# Altium project PCB_Project2.PrjPCB
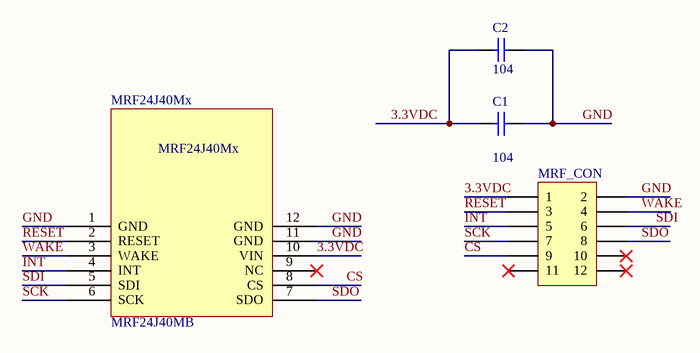
[diagram p0: Sheet2.SchDoc]
1 sheet, 4 parts. Net scope: global (net labels, ports and power ports of the same name join across sheets).
Board file: PCB1.PcbDoc

## Sheet Sheet2.SchDoc
size A

### Parts
C1  value 104  [CN1.5]  (hidden comment: Cap)
C2  value 104  [CN1.5]  (hidden comment: Cap)
MRF24J40Mx  MRF24J40MB  [MRF24J40MB]
MRF_CON  Header 6X2  [HDR2X6]  (value not drawn)

### Nets
3.3VDC: C1.2 C2.1 MRF24J40Mx.10(VIN) MRF_CON.1
CS: MRF24J40Mx.8(CS) MRF_CON.9
GND: C1.1 C2.2 MRF24J40Mx.1(GND) MRF24J40Mx.11(GND) MRF24J40Mx.12(GND) MRF_CON.2
INT: MRF24J40Mx.4(INT) MRF_CON.5
RESET: MRF24J40Mx.2(RESET) MRF_CON.3
SCK: MRF24J40Mx.6(SCK) MRF_CON.7
SDI: MRF24J40Mx.5(SDI) MRF_CON.6
SDO: MRF24J40Mx.7(SDO) MRF_CON.8
WAKE: MRF24J40Mx.3(WAKE) MRF_CON.4

Not connected (* = marked no-connect by the designer): MRF24J40Mx 9(NC)*; MRF_CON 10* 11* 12*

### Library data of the parts
C1 C2 = Cap: Capacitor; Published: 8-Jun-2000; LatestRevisionDate: 17-Jul-2002; LatestRevisionNote: Re-released for DXP Platform.; PackageReference: RAD-0.3; Publisher: Altium Limited; PackageDescription: Radial Cap, Thru-Hole; 2 Leads; 0.3 in Pin Spacing
MRF_CON = Header 6X2: Header, 6-Pin, Dual row; LatestRevisionDate: 17-Jul-2002; LatestRevisionNote: Re-released for DXP Platform.; Publisher: Altium Limited